# EAGLE design differential_led_board (EAGLE 9.2.1)

## Sheet 1 of 3: Differential RX; Input connectors; Power
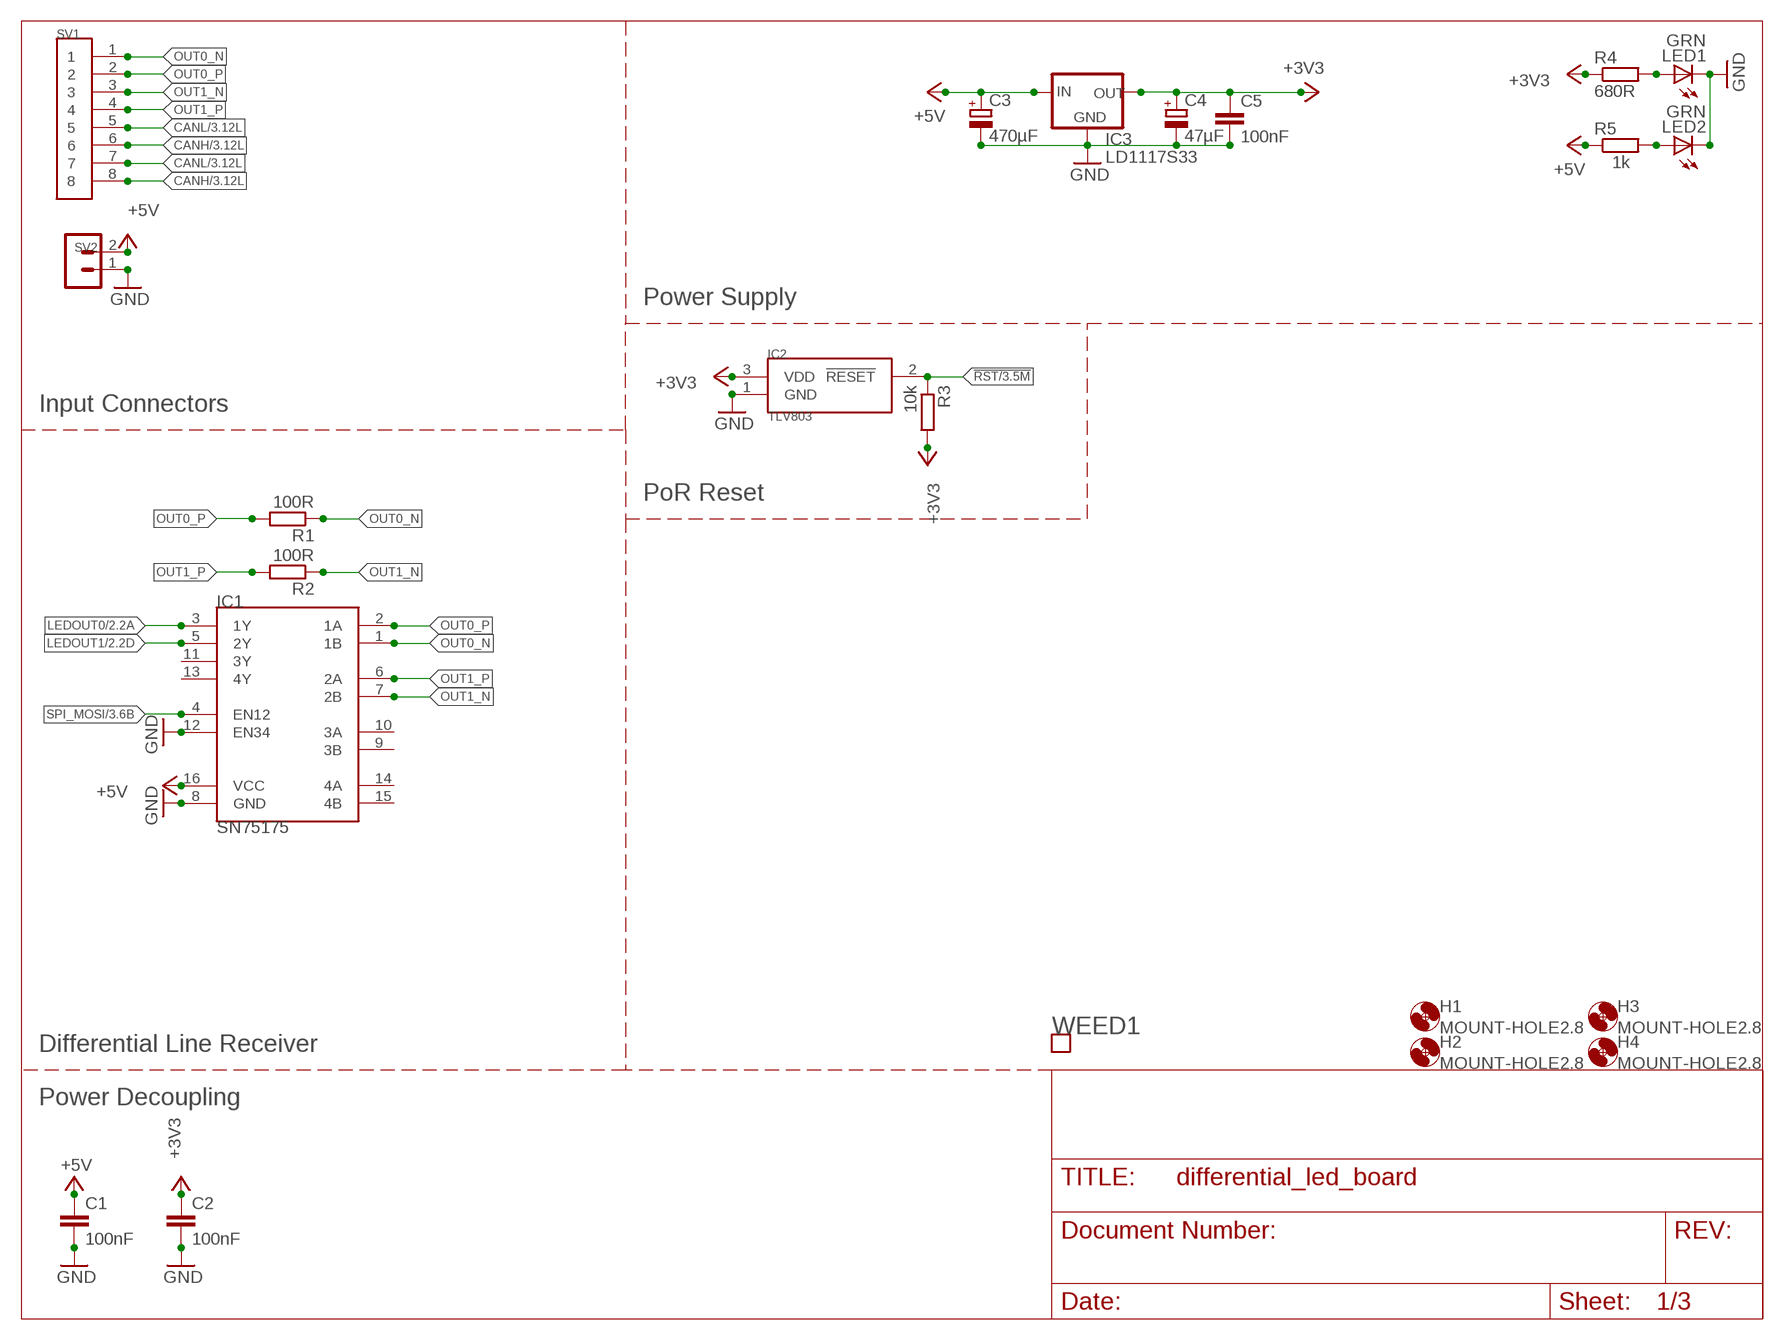
[diagram p0: schematic, sheet 1]

### Parts
C1  100nF  C-EUC0805  [C0805]
C2  100nF  C-EUC0805  [C0805]
C3  470µF  CPOL-EUUD-8X10  [UD-8X10_NICHICON]
C4  47µF  CPOL-EUCT6032  [CT6032]
C5  100nF  C-EUC0805  [C0805]
H1  MOUNT-HOLE2.8  [2,8]
H2  MOUNT-HOLE2.8  [2,8]
H3  MOUNT-HOLE2.8  [2,8]
H4  MOUNT-HOLE2.8  [2,8]
IC1  SN75175  SN75175SOP-16  [SOP-16]
IC2  TLV803  TLV803SOT-23  [SOT23]
IC3  LD1117S33  LM1117SOT223  [SOT223]
LED1  GRN  LEDCHIPLED_1206  [CHIPLED_1206]
LED2  GRN  LEDCHIPLED_1206  [CHIPLED_1206]
R1  100R  R-EU_M1206  [M1206]
R2  100R  R-EU_M1206  [M1206]
R3  10k  R-EU_M0805  [M0805]
R4  680R  R-EU_M0805  [M0805]
R5  1k  R-EU_M0805  [M0805]
SV1  SS-51000-003  [SS-51000-003]
SV2  1792863  [1792863]
WEED1  WEED  [DOINK]

### Nets
!RST: IC2.2(!RESET) R3.1 ; also sheet 3
+3V3: C2.1 C4.+ C5.1 IC2.3(VDD) IC3.2(OUT) IC3.4(OUT) R3.2 R4.1 ; also sheet 2,3
+5V: C1.1 C3.+ IC1.16(VCC) IC3.3(IN) R5.1 SV2.2 ; also sheet 2,3
CANH: SV1.6 SV1.8 ; also sheet 3
CANL: SV1.5 SV1.7 ; also sheet 3
GND: C1.2 C2.2 C3.- C4.- C5.2 IC1.8(GND) IC1.12(EN34) IC2.1(GND) IC3.1(GND) LED1.C LED2.C SV2.1 ; also sheet 2,3
LEDOUT0: IC1.3(1Y) ; also sheet 2
LEDOUT1: IC1.5(2Y) ; also sheet 2
N$1: LED1.A R4.2
N$2: LED2.A R5.2
OUT0_N: IC1.1(1B) R1.1 SV1.1
OUT0_P: IC1.2(1A) R1.2 SV1.2
OUT1_N: IC1.7(2B) R2.1 SV1.3
OUT1_P: IC1.6(2A) R2.2 SV1.4
SPI_MOSI: IC1.4(EN12) ; also sheet 3
Unconnected: IC1.9(3B) IC1.10(3A) IC1.11(3Y) IC1.13(4Y) IC1.14(4A) IC1.15(4B)

### Notes on the sheet
- Power Supply
- Input Connectors
- PoR Reset
- Differential Line Receiver
- Power Decoupling

## Sheet 2 of 3: Output MUX; LED connectors
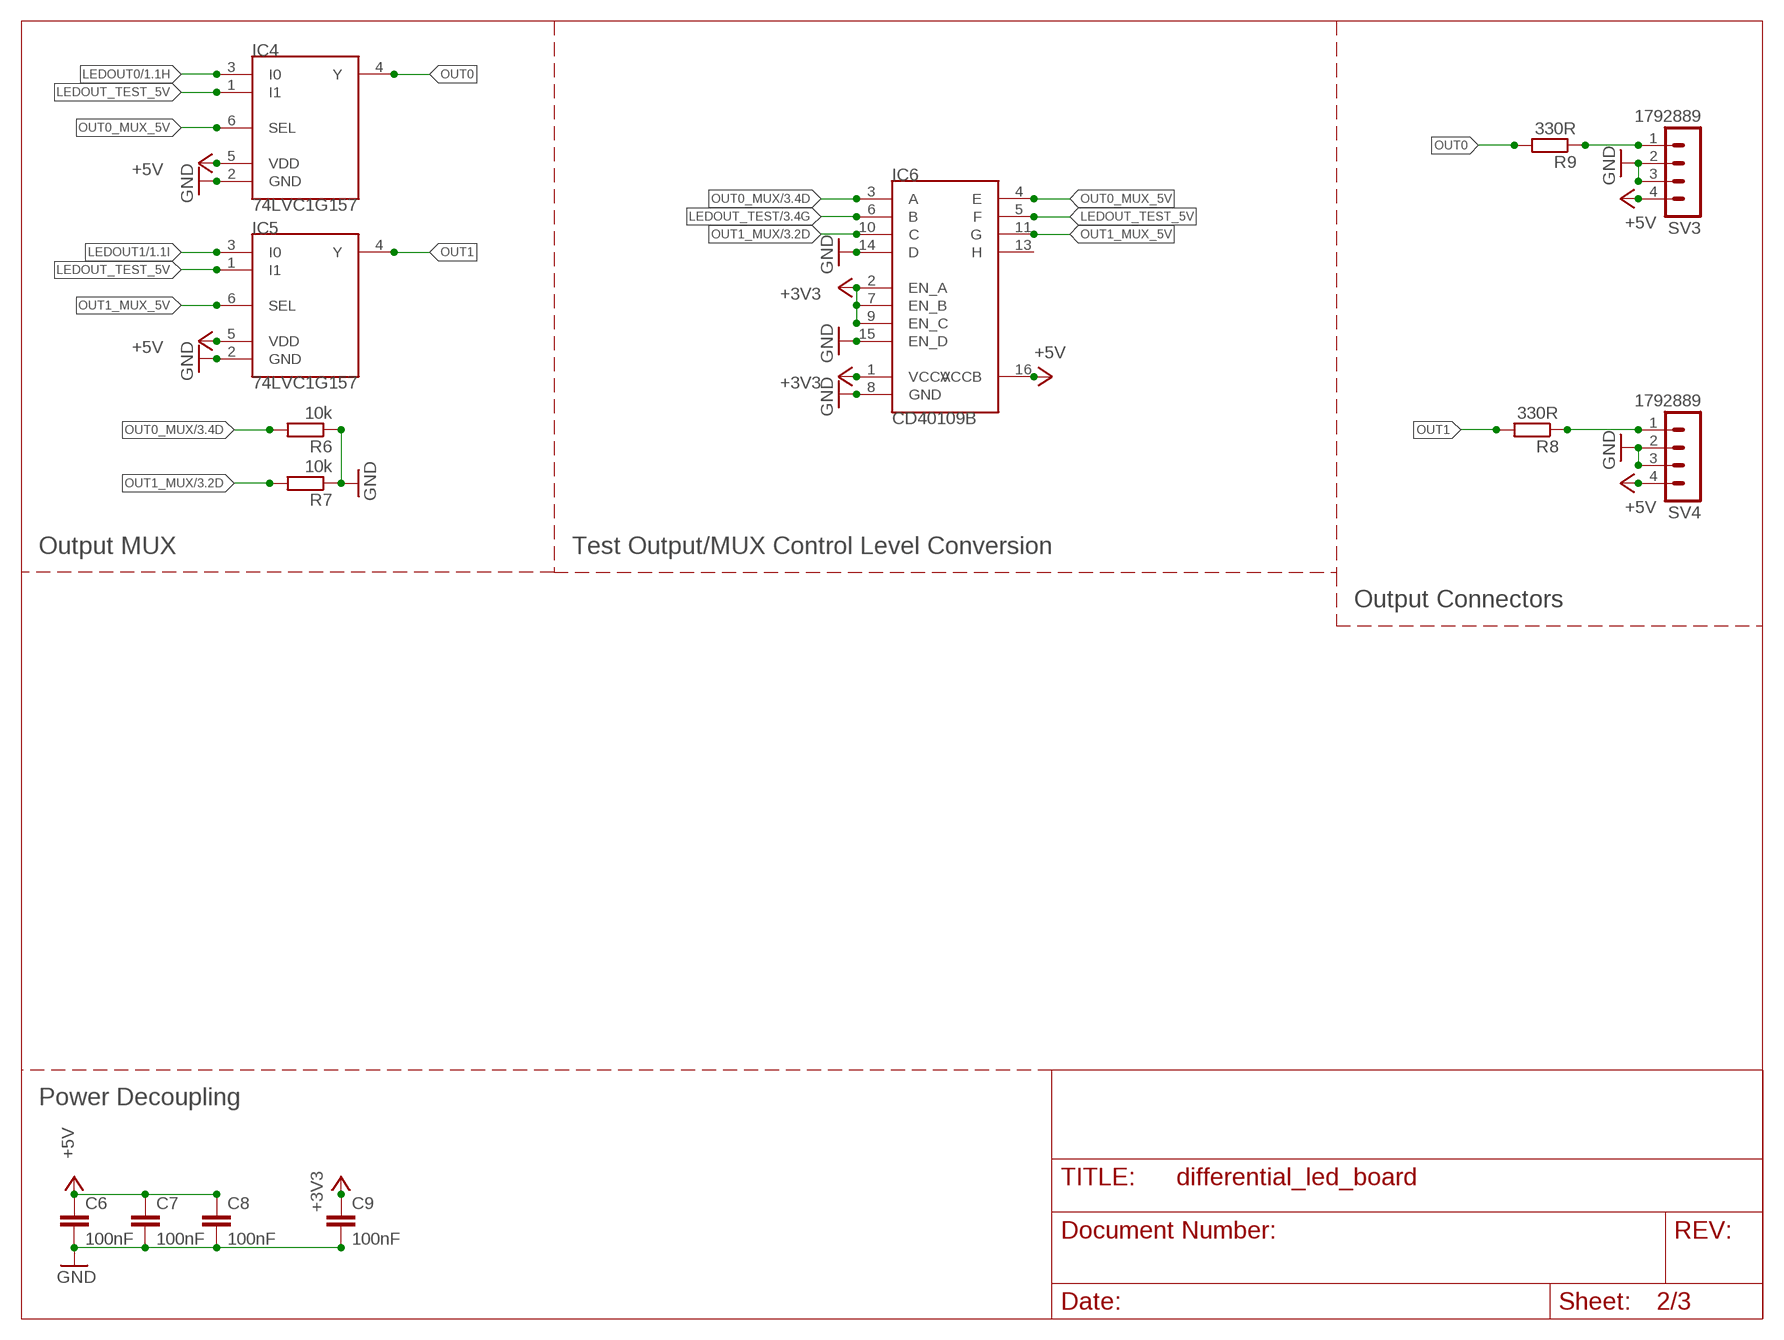
[diagram p1: schematic, sheet 2]

### Parts
C6  100nF  C-EUC0805  [C0805]
C7  100nF  C-EUC0805  [C0805]
C8  100nF  C-EUC0805  [C0805]
C9  100nF  C-EUC0805  [C0805]
IC4  74LVC1G157  74LVC1G157SOT457  [SOT457R_PHILIPS]
IC5  74LVC1G157  74LVC1G157SOT457  [SOT457R_PHILIPS]
IC6  CD40109B  CD40109BSO-16  [SO16]
R6  10k  R-EU_M0805  [M0805]
R7  10k  R-EU_M0805  [M0805]
R8  330R  R-EU_M0805  [M0805]
R9  330R  R-EU_M0805  [M0805]
SV3  1792889  [1792889]
SV4  1792889  [1792889]

### Nets
+3V3: C9.1 IC6.1(VCCA) IC6.2(EN_A) IC6.7(EN_B) IC6.9(EN_C) ; also sheet 1,3
+5V: C6.1 C7.1 C8.1 IC4.5(VDD) IC5.5(VDD) IC6.16(VCCB) SV3.4 SV4.4 ; also sheet 1,3
GND: C6.2 C7.2 C8.2 C9.2 IC4.2(GND) IC5.2(GND) IC6.8(GND) IC6.14(D) IC6.15(EN_D) R6.1 R7.1 SV3.2 SV3.3 SV4.2 SV4.3 ; also sheet 1,3
LEDOUT0: IC4.3(I0) ; also sheet 1
LEDOUT1: IC5.3(I0) ; also sheet 1
LEDOUT_TEST: IC6.6(B) ; also sheet 3
LEDOUT_TEST_5V: IC4.1(I1) IC5.1(I1) IC6.5(F)
N$3: R8.1 SV4.1
N$6: R9.1 SV3.1
OUT0: IC4.4(Y) R9.2
OUT0_MUX: IC6.3(A) R6.2 ; also sheet 3
OUT0_MUX_5V: IC4.6(SEL) IC6.4(E)
OUT1: IC5.4(Y) R8.2
OUT1_MUX: IC6.10(C) R7.2 ; also sheet 3
OUT1_MUX_5V: IC5.6(SEL) IC6.11(G)
Unconnected: IC6.13(H)

### Notes on the sheet
- Output MUX | Test Output/MUX Control Level Conversion
- Output Connectors
- Power Decoupling

## Sheet 3 of 3: CANnabus Controller
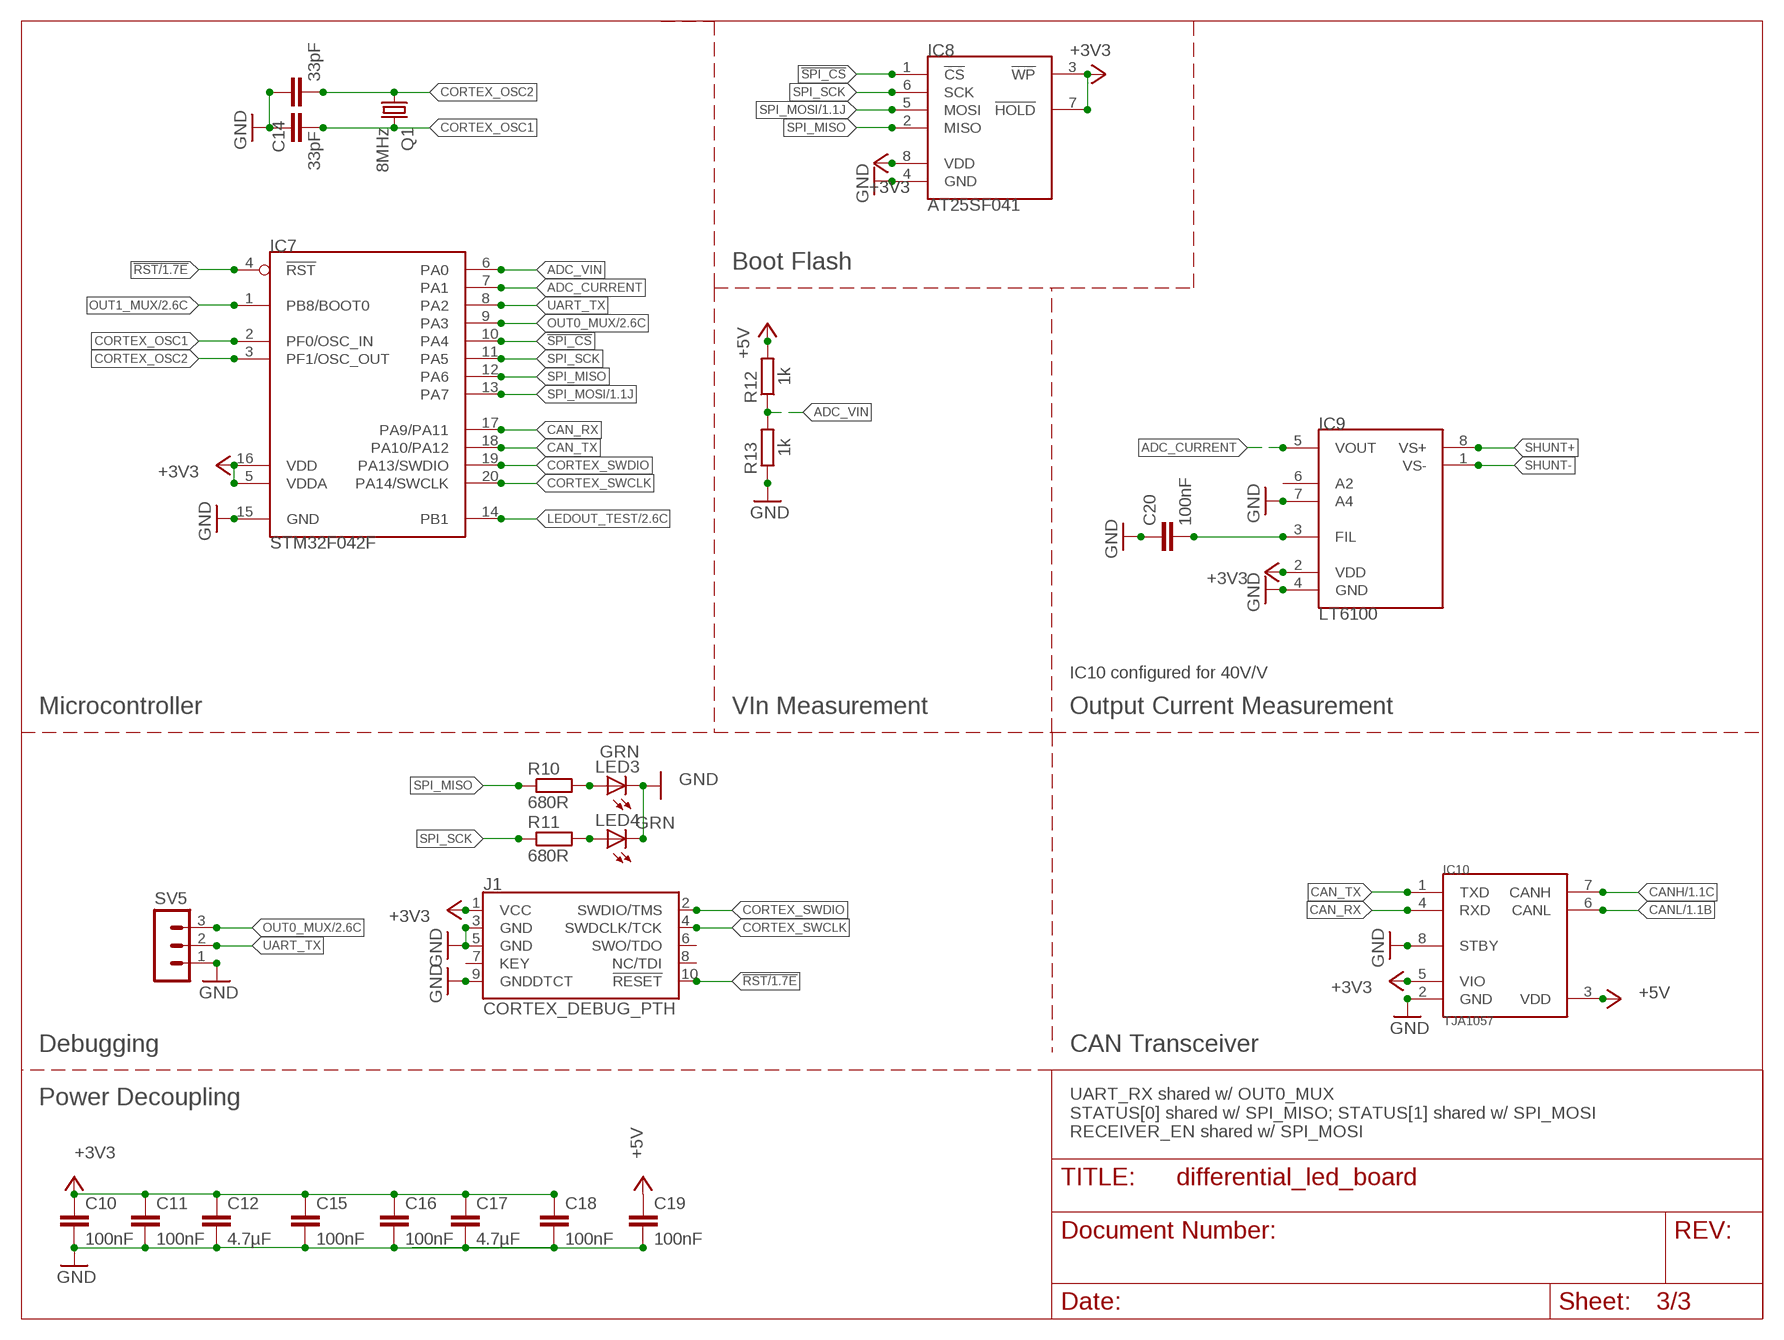
[diagram p2: schematic, sheet 3]

### Parts
C10  100nF  C-EUC0805  [C0805]
C11  100nF  C-EUC0805  [C0805]
C12  4.7µF  C-EUC0805  [C0805]
C13  33pF  C-EUC0805  [C0805]
C14  33pF  C-EUC0805  [C0805]
C15  100nF  C-EUC0805  [C0805]
C16  100nF  C-EUC0805  [C0805]
C17  4.7µF  C-EUC0805  [C0805]
C18  100nF  C-EUC0805  [C0805]
C19  100nF  C-EUC0805  [C0805]
C20  100nF  C-EUC0805  [C0805]
IC7  STM32F042F  [TSSOP20]
IC8  AT25SF041  [SOIC8]
IC9  LT6100  LT6100MSOP-8  [MSOP8]
IC10  TJA1057  [SOIC8]
J1  CORTEX_DEBUG_PTH  [2X5-PTH-1.27MM]
LED3  GRN  LEDCHIPLED_1206  [CHIPLED_1206]
LED4  GRN  LEDCHIPLED_1206  [CHIPLED_1206]
Q1  8MHz  CRYSTALHC49UP  [HC49UP]
R10  680R  R-EU_M0805  [M0805]
R11  680R  R-EU_M0805  [M0805]
R12  1k  R-EU_M0805  [M0805]
R13  1k  R-EU_M0805  [M0805]
SV5  MA03-1  [MA03-1]

### Nets
!RST: IC7.4(!RST) J1.10(!RESET) ; also sheet 1
!SPI_CS: IC7.10(PA4) IC8.1(!CS)
+3V3: C10.1 C11.1 C12.1 C15.1 C16.1 C17.1 C18.1 IC7.5(VDDA) IC7.16(VDD) IC8.3(!WP) IC8.7(!HOLD) IC8.8(VDD) IC9.2(VDD) IC10.5(VIO) J1.1(VCC) ; also sheet 1,2
+5V: C19.1 IC10.3(VDD) R12.2 ; also sheet 1,2
ADC_CURRENT: IC7.7(PA1) IC9.5(VOUT)
ADC_VIN: IC7.6(PA0) R12.1 R13.2
CAN_RX: IC7.17(PA9/PA11) IC10.4(RXD)
CAN_TX: IC7.18(PA10/PA12) IC10.1(TXD)
CANH: IC10.7(CANH) ; also sheet 1
CANL: IC10.6(CANL) ; also sheet 1
CORTEX_OSC1: C14.2 IC7.2(PF0/OSC_IN) Q1.2
CORTEX_OSC2: C13.2 IC7.3(PF1/OSC_OUT) Q1.1
CORTEX_SWCLK: IC7.20(PA14/SWCLK) J1.4(SWDCLK/TCK)
CORTEX_SWDIO: IC7.19(PA13/SWDIO) J1.2(SWDIO/TMS)
GND: C10.2 C11.2 C12.2 C13.1 C14.1 C15.2 C16.2 C17.2 C18.2 C19.2 C20.1 IC7.15(GND) IC8.4(GND) IC9.4(GND) IC9.7(A4) IC10.2(GND) IC10.8(STBY) J1.3(GND) J1.5(GND) J1.9(GNDDTCT) LED3.C LED4.C R13.1 SV5.1 ; also sheet 1,2
LEDOUT_TEST: IC7.14(PB1) ; also sheet 2
N$4: LED3.A R10.2
N$5: LED4.A R11.2
N$7: C20.2 IC9.3(FIL)
OUT0_MUX: IC7.9(PA3) SV5.3 ; also sheet 2
OUT1_MUX: IC7.1(PB8/BOOT0) ; also sheet 2
SHUNT+: IC9.8(VS+)
SHUNT-: IC9.1(VS-)
SPI_MISO: IC7.12(PA6) IC8.2(MISO) R10.1
SPI_MOSI: IC7.13(PA7) IC8.5(MOSI) ; also sheet 1
SPI_SCK: IC7.11(PA5) IC8.6(SCK) R11.1
UART_TX: IC7.8(PA2) SV5.2
Unconnected: IC9.6(A2) J1.6(SWO/TDO) J1.7(KEY) J1.8(NC/TDI)

### Notes on the sheet
- Boot Flash
- IC10 configured for 40V/V
- Microcontroller | VIn Measurement | Output Current Measurement
- Debugging | CAN Transceiver
- UART_RX shared w/ OUT0_MUX
  STATUS[0] shared w/ SPI_MISO; STATUS[1] shared w/ SPI_MOSI
  RECEIVER_EN shared w/ SPI_MOSI
- Power Decoupling

## Library data of the parts
C1 C2 C5-C11 C15 C16 C18 C19 = rcl:C-EU: CAPACITOR, European symbol; MOUSER: 710-885012207072; SPICEPREFIX: C
C3 = rcl:CPOL-EU: POLARIZED CAPACITOR, European symbol; MOUSER: 647-UWT1C471MNL1S; SPICEPREFIX: C
C4 = rcl:CPOL-EU: POLARIZED CAPACITOR, European symbol; MOUSER: 581-TAJD476M016RNJV; SPICEPREFIX: C
C12 C17 = rcl:C-EU: CAPACITOR, European symbol; MOUSER: 81-GRM21BR71A475ME1L; SPICEPREFIX: C
C13 C14 = rcl:C-EU: CAPACITOR, European symbol; MOUSER: 710-885012007013; SPICEPREFIX: C
C20 = rcl:C-EU: CAPACITOR, European symbol; MOUSER: 710-885012007059; SPICEPREFIX: C
H1-H4 = holes:MOUNT-HOLE: MOUNTING HOLE with drill center marker
IC1 = lichtenstein_onion:SN75175: QUADRUPLE DIFFERENTIAL LINE RECEIVERS Datasheet <http://www.ti.com/lit/ds/symlink/sn75175.pdf>; MOUSER: 595-SN75175DR
IC2 = lichtenstein_onion:TLV803: 3-Pin Voltage Supervisors with Active-Low, Open-Drain Reset Datasheet <http://www.ti.com/general/docs/lit/getliterature.tsp?genericPartNumber=tlv803&fileType=pdf> Note: Mouser part number for TLV803S; 2.93V threshold voltage; MOUSER: 595-TLV803SDBZR
IC3 = lichtenstein_onion:LM1117: Voltage Regulator LM1117 Information <http://www.st.com/en/power-management/ld1117.html>; MOUSER: 926-LM1117MPX3.3NOPB
IC4 IC5 = lichtenstein_onion:74LVC1G157: Single 2-input multiplexer Datasheet <https://www.mouser.com/datasheet/2/916/74LVC1G157-1319565.pdf>; MOUSER: 771-74LVC1G157GV-G
IC6 = lichtenstein_onion:CD40109B: Automotive catalog CMOS Quad Low-to-High Voltage Level Shifter (20V Rating) Datasheet <http://www.ti.com/lit/ds/symlink/cd40109b-q1.pdf>; MOUSER: 595-CD40109BNSR
IC7 = lichtenstein_onion:STM32F042F: STM32F042Fx – Mainstream ARM Cortex-M0 USB line MCU with 32 Kbytes Flash, 48 MHz CPU, USB, CAN and CEC functions Datasheet <https://www.st.com/resource/en/datasheet/stm32f042f6.pdf> STM32F042x6 <https://www.st.com/content/st_com/en/products/microcontrollers/stm32-32-bit-arm-cortex-mcus/stm32-mainstream-mcus/stm32f0-series/stm32f0x2/stm32f042f6.html>: 32K flash, 6K SRAM STM32F042x4 <https://www.st.com/content/st_com/en/products/microcontrollers/stm32-32-bit-arm-cortex-mcus/stm32-mainstream-mcus/stm32f0-series/stm32f0x2/stm32f042f4.html>: 16K flash, 6K SRAM; MOUSER: 511-STM32F042F6P6
IC8 = lichtenstein_onion:AT25SF041: AT25SF041 – 4-Mbit, 2.5V Minimum SPI Serial Flash Memory with Dual-I/O and Quad-I/O Support Datasheet <https://www.mouser.com/datasheet/2/590/DS-AT25SF041_044-1385758.pdf>; MOUSER: 988-AT25SF041-SSHD-T
IC9 = lichtenstein_onion:LT6100: Precision, Gain Selectable High Side Current Sense Amplifier Datasheet <https://www.analog.com/media/en/technical-documentation/data-sheets/6100fd.pdf>; MOUSER: 584-LT6100CMS8#PBF
IC10 = lichtenstein_onion:TJA1057: TJA1057 – High-speed CAN transceiver Information <https://www.nxp.com/products/analog/interfaces/in-vehicle-network/can-transceiver-and-controllers/high-speed-can-transceiver-mantis-family:TJA1057> Datasheet <https://www.nxp.com/docs/en/data-sheet/TJA1057.pdf>; MOUSER: 771-TJA1057GT/3J
J1 = lichtenstein_onion:CORTEX_DEBUG: Cortex Debug Connector - 10 pin; MOUSER: 649-221111-00010T4LF
LED1-LED4 = led:LED: LED OSRAM: - CHIPLED LG R971, LG N971, LY N971, LG Q971, LY Q971, LO R971, LY R971 LH N974, LH R974 LS Q976, LO Q976, LY Q976 LO Q996 - Hyper CHIPLED LW Q18S LB Q993, LB Q99A, LB R99A - SideLED LS A670, LO A670, LY A670, LG A670, LP A670 LB A673, LV A673, LT A673, LW A673 LH A674 LY A675 LS A676, LA A676, LO A676, LY A676, LW A676 LS A679, LY A679, LG A679 - Hyper Micro SIDELED® LS Y876, LA Y876, LO Y876, LY Y876 LT Y87S - SmartLED LW L88C, LW L88S LB L89C, LB L89S, LG L890 LS L89K, LO L89K, LY L89K LS L896, LA L896, LO L896, LY L896 - TOPLED LS T670, LO T670, LY T670, LG T670, LP T670 LSG T670, LSP T670, LSY T670, LOP T670, LYG T670 LG T671, LOG T671, LSG T671 LB T673, LV T673, LT T673, LW T673 LH T674 LS T676, LA T676, LO T676, LY T676, LB T676, LH T676, LSB T676, LW T676 LB T67C, LV T67C, LT T67C, LS T67K, LO T67K, LY T67K, LW E67C LS E67B, LA E67B, LO E67B, LY E67B, LB E67C, LV E67C, LT E67C LW T67C LS T679, LY T679, LG T679 LS T770, LO T770, LY T770, LG T770, LP T770 LB T773, LV T773, LT T773, LW T773 LH T774 LS E675, LA E675, LY E675, LS T675 LS T776, LA T776, LO T776, LY T776, LB T776 LHGB T686 LT T68C, LB T68C - Hyper Mini TOPLED® LB M676 - Mini TOPLED Santana® LG M470 LS M47K, LO M47K, LY M47K Source: http://www.osram.convergy.de LUXEON: - LUMILED® LXK2-PW12-R00, LXK2-PW12-S00, LXK2-PW14-U00, LXK2-PW14-V00 LXK2-PM12-R00, LXK2-PM12-S00, LXK2-PM14-U00 LXK2-PE12-Q00, LXK2-PE12-R00, LXK2-PE12-S00, LXK2-PE14-T00, LXK2-PE14-U00 LXK2-PB12-K00, LXK2-PB12-L00, LXK2-PB12-M00, LXK2-PB14-N00, LXK2-PB14-P00, LXK2-PB14-Q00 LXK2-PR12-L00, LXK2-PR12-M00, LXK2-PR14-Q00, LXK2-PR14-R00 LXK2-PD12-Q00, LXK2-PD12-R00, LXK2-PD12-S00 LXK2-PH12-R00, LXK2-PH12-S00 LXK2-PL12-P00, LXK2-PL12-Q00, LXK2-PL12-R00 Source: www.luxeon.com KINGBRIGHT: KA-3528ASYC Source: www.kingbright.com; MOUSER: 604-APTR3216SGC
Q1 = crystal:CRYSTAL: CRYSTAL; MOUSER: 449-LFXTAL030234REEL; OC_FARNELL: unknown; OC_NEWARK: unknown
R1 R2 = rcl:R-EU_: RESISTOR, European symbol; MOUSER: 652-CR1206FX-1000ELF; SPICEPREFIX: R
R3 R6 R7 = rcl:R-EU_: RESISTOR, European symbol; MOUSER: 755-ESR10EZPJ103; SPICEPREFIX: R
R4 R10 R11 = rcl:R-EU_: RESISTOR, European symbol; MOUSER: 652-CR0805-FX6800GLF; SPICEPREFIX: R
R5 R12 R13 = rcl:R-EU_: RESISTOR, European symbol; MOUSER: 755-ESR10EZPJ102; SPICEPREFIX: R
R8 R9 = rcl:R-EU_: RESISTOR, European symbol; MOUSER: 71-CRCW0805330RFKEAC; SPICEPREFIX: R
SV1 = lichtenstein_onion:SS-51000-003: SS-51000-003 – Unshielded, CAT6a, Punch Down Block, 8P 8C Information <https://belfuse.com/product/part-details?partn=SS-51000-003> Mechanical Drawing <https://belfuse.com/resources/drawings/stewartconnector/dr-stw-ss-51000-003.pdf> Compatible with SS-51000-004 (same connector but with color coded terminals for CAT6 cable); MOUSER: 530-SS-51000-003
SV2 = lichtenstein_onion:1792863: PCB terminal block - PTS 1,5/ 2-5,0-H - 1792863 Footprint Proven Information <https://www.phoenixcontact.com/online/portal/us?uri=pxc-oc-itemdetail:pid=1792863&library=usen&tab=1>; MOUSER: 651-1792863
SV3 SV4 = lichtenstein_onion:1792889; MOUSER: 651-1792889
SV5 = con-lstb:MA03-1: PIN HEADER; OC_FARNELL: unknown; OC_NEWARK: unknown
WEED1 = lichtenstein_onion:WEED

## Net classes
0 default: width 0.254 mm
1 hi_power: width 2.54 mm

## Board
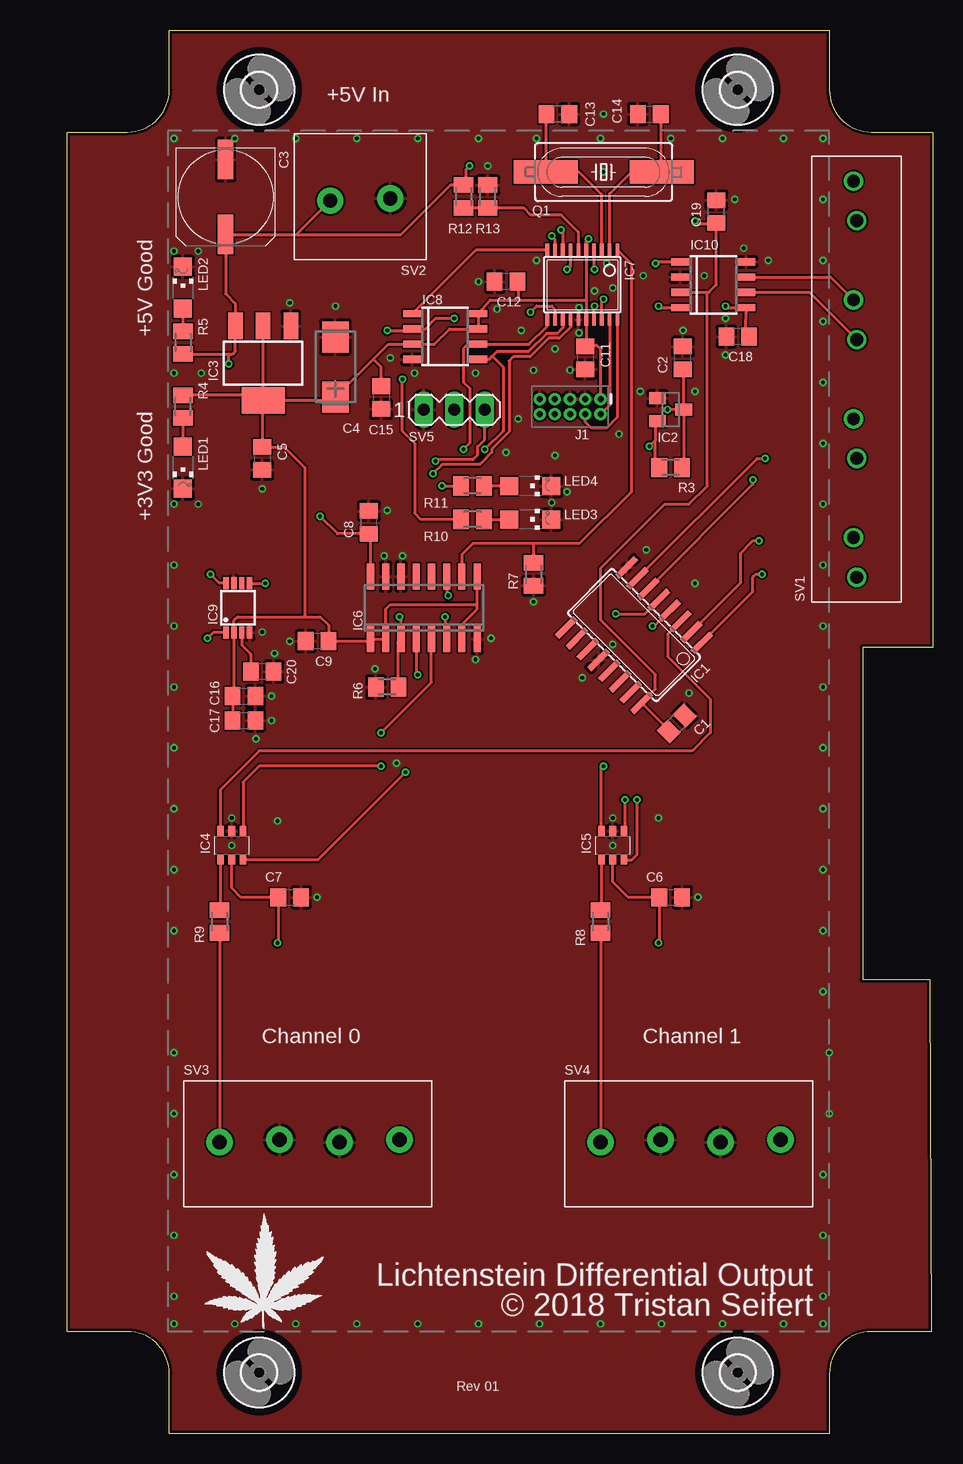
[diagram p3: board, top side]
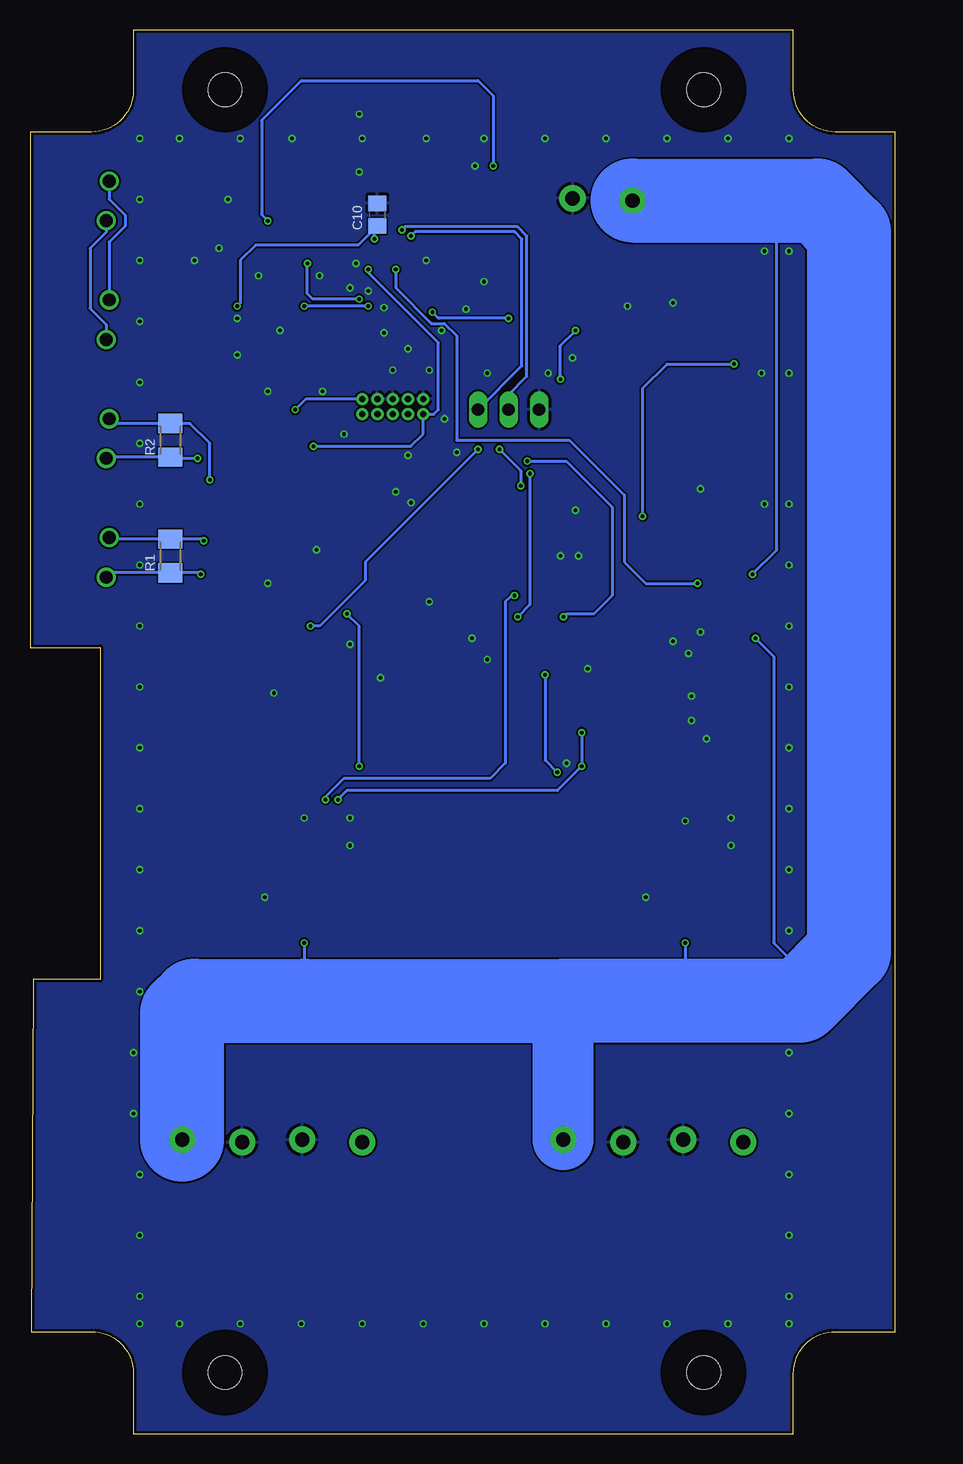
[diagram p4: board, bottom side, seen from below]

Size 72.12 x 117 mm. Coordinates in mm from the lower left corner, seen from the top.
Outline: 0,8.5 0,108.5 5,108.5 arc90 8.5,112 8.5,117 63.5,117 63.5,112 arc90 67,108.5 72.12,108.5 72.12,65.54 66.28,65.54 66.28,37.85 71.87,37.85 71.87,37.34 72,8.5 67,8.5 arc90 63.5,5 63.5,0 8.5,0 8.5,5 arc90 5,8.5 0,8.5
Copper layers (1*16): Top 0.035mm / dielectric 1.5mm / Bottom 0.035mm
Design rules "dirt_cheap_dirty_boards.v1.1": minimum track width 6mil, minimum drill 12mil, track to track 6mil, track to pad 6mil, pad to pad 6mil, via to via 6mil, smd to smd 0mil, copper to edge 10mil, drill to drill 10mil, minimum pad ring 10mil, minimum via ring 6mil, stop-mask expansion 2mil, vias tented up to drill 25mil, thermal gap 10mil

### Footprints (pad centres in the part's own frame; a part is rotated, then mirrored left to right if it is on the bottom)
C0805 = smd 1.3 x 1.5: 1 -0.95,0; 2 0.95,0
UD-8X10_NICHICON = smd 3.3 x 1.3: + 3.125,0; - -3.125,0
CT6032 = smd 2.6 x 2.2: + -2.5,0; - 2.5,0
2,8 = hole 2.8: 0,0
SOP-16 = smd 0.5 x 2.2: 1 -4.445,-3.55; 2 -3.185,-3.55; 3 -1.915,-3.55; 4 -0.645,-3.55; 5 0.635,-3.55; 6 1.895,-3.55; 7 3.165,-3.55; 8 4.435,-3.55; 9 4.445,3.55; 10 3.175,3.55; 11 1.905,3.55; 12 0.635,3.55; 13 -0.635,3.55; 14 -1.905,3.55; 15 -3.175,3.55; 16 -4.445,3.55
SOT23 = smd 1 x 1.4: 1 -0.95,-1.1; 2 0.95,-1.1; 3 0,1.1
SOT223 = smd 1.219 x 2.235: 1 -2.311,-3.099; 2 0,-3.099; 3 2.311,-3.099 | smd 3.6 x 2.2: 4 0,3.099
SOT457R_PHILIPS = smd 0.55 x 0.8: 1 -0.95,-1.2; 2 0,-1.2; 3 0.95,-1.2; 4 0.95,1.2; 5 0,1.2; 6 -0.95,1.2
SO16 = smd 0.6 x 2.2: 1 -4.445,-2.6; 2 -3.175,-2.6; 3 -1.905,-2.6; 4 -0.635,-2.6; 5 0.635,-2.6; 6 1.905,-2.6; 7 3.175,-2.6; 8 4.445,-2.6; 9 4.445,2.6; 10 3.175,2.6; 11 1.905,2.6; 12 0.635,2.6; 13 -0.635,2.6; 14 -1.905,2.6; 15 -3.175,2.6; 16 -4.445,2.6
TSSOP20 = smd 0.305 x 0.991: 1 -2.925,-2.918; 2 -2.275,-2.918; 3 -1.625,-2.918; 4 -0.975,-2.918; 5 -0.325,-2.918; 6 0.325,-2.918; 7 0.975,-2.918; 8 1.625,-2.918; 9 2.275,-2.918; 10 2.925,-2.918; 11 2.925,2.918; 12 2.275,2.918; 13 1.625,2.918; 14 0.975,2.918; 15 0.325,2.918; 16 -0.325,2.918; 17 -0.975,2.918; 18 -1.625,2.918; 19 -2.275,2.918; 20 -2.925,2.918
SOIC8 = smd 0.6 x 1.5: 1 -1.905,-2.75; 2 -0.635,-2.75; 3 0.635,-2.75; 4 1.905,-2.75; 5 1.905,2.75; 6 0.635,2.75; 7 -0.635,2.75; 8 -1.905,2.75
MSOP8 = smd 0.45 x 1: 1 -0.975,-2.05; 2 -0.325,-2.05; 3 0.325,-2.05; 4 0.975,-2.05; 5 0.975,2.05; 6 0.325,2.05; 7 -0.325,2.05; 8 -0.975,2.05
2X5-PTH-1.27MM = drill 0.508 pad 1: 1 -2.54,-0.635; 2 -2.54,0.635; 3 -1.27,-0.635; 4 -1.27,0.635; 5 0,-0.635; 6 0,0.635; 7 1.27,-0.635; 8 1.27,0.635; 9 2.54,-0.635; 10 2.54,0.635
CHIPLED_1206 = smd 1.5 x 1.5: A 0,-1.75; C 0,1.75
HC49UP = smd 5.334 x 1.93: 1 -4.826,0; 2 4.826,0
M1206 = smd 1.6 x 2: 1 -1.4,0; 2 1.4,0
M0805 = smd 1.3 x 1.6: 1 -0.95,0; 2 0.95,0
SS-51000-003 = drill 1.067: 1 0,0; 2 3.302,0.254; 3 9.906,0; 4 13.208,0.254; 5 19.812,0; 6 23.114,0.254; 7 29.718,0; 8 33.02,0.254
1792863 = drill 1.2 pad 2.2: 1 0,-0.1; 2 5,0.1
1792889 = drill 1.2 pad 2.2: 1 -7.62,-0.1; 2 -2.62,0.1; 3 2.38,-0.1; 4 7.38,0.1
MA03-1 = drill 1.016 long: 1 -2.54,0; 2 0,0; 3 2.54,0

### Placement (x,y rotation side)
C1  50.79,59.19 45 top
C2  51.29,89.67 90 top
C3  13.19,103.08 270 top
C4  22.34,88.9 90 top
C5  16.24,81.28 270 top
C6  50.28,44.71 0 top
C7  18.53,44.71 0 top
C8  25.13,75.95 90 top
C9  20.81,66.04 180 top
C10  43.17,101.6 90 bottom
C11  43.17,89.67 270 top
C12  36.56,96.02 180 top
C13  40.88,109.99 180 top
C14  48.5,109.99 0 top
C15  26.15,86.36 270 top
C16  14.72,61.47 0 top
C17  14.72,59.44 0 top
C18  55.87,91.44 180 top
C19  54.09,101.86 90 top
C20  16.24,63.5 180 top
H1  15.99,112.02 0 top
H2  15.99,5.08 0 top
H3  55.87,5.08 0 top
H4  55.87,112.02 0 top
IC1  47.23,66.55 135 top
IC2  50.28,85.35 270 top
IC3  16.32,89.23 180 top
IC4  13.7,49.03 180 top
IC5  45.45,49.03 180 top
IC6  29.7,68.84 0 top
IC7  42.91,95.76 180 top
IC8  31.48,91.44 270 top
IC9  14.21,68.84 0 top
IC10  53.83,95.76 270 top
J1  41.9,85.6 180 top
LED1  9.64,80.52 180 top
LED2  9.64,95.51 0 top
LED3  38.59,76.2 270 top
LED4  38.59,79 270 top
Q1  44.69,105.16 0 top
R1  60.44,73.16 90 bottom
R2  60.44,82.81 90 bottom
R3  50.28,80.52 0 top
R4  9.64,85.6 270 top
R5  9.64,90.94 90 top
R6  26.66,62.23 0 top
R7  38.85,71.63 90 top
R8  44.44,42.68 90 top
R9  12.69,42.68 90 top
R10  33.77,76.2 0 top
R11  33.77,79 0 top
R12  33.01,103.13 90 top
R13  35.04,103.13 270 top
SV1  65.77,71.38 90 top
SV2  26.91,102.87 180 top
SV3  20.31,24.39 0 top
SV4  52.06,24.39 0 top
SV5  32.24,85.35 0 top
WEED1  11.42,8.64 0 top

### Tracks (layer width: path | path; a pad name or v marks a point on that pad's centre or on a via)
!RST  (via drill 0.3)
  Top 0.254: IC7.4 43.89,97.07 v43.93,97.03 | IC2.2 49.01,84.23 49.01,83.06 49.01,82.81 | 49.01,82.81 v48.5,82.3 | R3.1 49.01,80.84 49.01,82.81
  Bottom 0.254: v43.93,97.03 43.93,96.78 38.09,90.94 38.09,85.35 38.47,84.97 J1.10 39.36,83.32 40.37,82.3 v48.5,82.3
!SPI_CS
  Top 0.254: IC8.1 34.06,98.68 IC7.10
+3V3  (via drill 0.3)
  Top 0.254: R4.1 15.9,86.55 IC3.4 | IC3.4 22.07,86.14 C4.+ 25.49,89.56 | IC3.4 16.24,86.06 C5.1 18.09,82.23 19.8,80.52 19.8,68.08 | 25.49,89.56 26.74,90.81 IC8.3 30.59,90.81 31.86,92.08 IC8.7 IC8.8 35.23,94.49 37.58,94.49 | 43.24,94.49 IC7.16 43.24,90.69 | 37.58,94.49 43.24,94.49 | 43.24,94.49 IC7.5 43.24,99.39 v43.42,99.57 | C15.1 26.15,88.9 25.49,89.56 | C12.1 37.58,95.95 37.58,94.49 | 43.24,90.69 C11.1 | J1.1 44.44,90.43 44.18,90.69 43.24,90.69 | C18.1 56.43,91.83 IC10.5 54.98,93.86 v54.85,93.98 | IC3.4 IC3.2 | C17.1 C16.1 13.89,61.59 IC9.2 13.89,67.75 14.21,68.08 19.8,68.08 | IC6.7 32.88,67.44 34.15,68.71 34.15,69.09 | 34.15,69.09 IC6.9 | 19.8,68.08 21.07,68.08 21.76,67.38 C9.1 25.07,66.04 IC6.1 IC6.2 26.53,68.71 26.91,69.09 34.15,69.09 | IC2.3 v50.02,85.35 | IC2.3 51.38,88.63 C2.1 | IC2.3 51.38,80.67 R3.2
  Bottom 0.254: v43.42,99.57 43.42,100.4 C10.1 44.76,99.06 53.33,99.06 54.6,97.79 54.6,94.24 v54.85,93.98 | J1.1 49.14,86.24 v50.02,85.35
+5V  (via drill 0.3)
  Top 0.254: R5.1 13.45,89.99 | 13.45,89.99 13.77,89.99 14.01,90.23 IC3.3 14.01,94.19 13.19,95 C3.+ 19.09,99.95 | 19.09,99.95 SV2.2 | 19.09,99.95 27.8,99.95 31.92,104.08 R12.2 33.26,104.33 33.26,105.41 v33.51,105.67 | IC10.3 53.33,95.13 | 53.33,95.13 53.45,95.13 54.09,95.76 C19.1 54.02,100.84 52.56,100.84 v52.31,101.1 | C1.1 50.11,58.65 IC1.16 49.01,62.04 49.01,63.25 44.44,67.82 44.44,72.14 49.77,77.47 51.8,77.47 53.33,79 53.33,95.13 | IC4.5 13.7,45.47 14.46,44.71 C7.1 17.58,40.96 v17.51,40.9 | IC5.5 45.45,45.98 46.72,44.71 C6.1 49.33,40.96 v49.26,40.9 | IC6.16 25.26,74.87 C8.1 22.53,75 v21.07,76.46 | v13.45,89.16 13.45,89.99
  Bottom 0.254: v52.31,101.1 52.82,101.6 52.82,109.48 49.52,112.78 34.78,112.78 33.51,111.51 v33.51,105.67 | v49.26,40.9 49.26,36.07 | v17.51,40.9 17.51,36.07 | v21.07,76.46 21.07,87.13 19.04,89.16 v13.45,89.16
  Bottom 5.08: SV3.4 27.69,36.06
  Bottom 6.985: SV2.2 6.49,102.77 3.87,100.16 3.87,40.14 7.94,36.07 17.51,36.07 27.67,36.07 | 27.67,36.07 49.26,36.07 58.41,36.07 59.44,35.04 SV4.4 | 27.69,36.06 27.67,36.07
ADC_CURRENT  (via drill 0.3)
  Top 0.254: IC7.7 41.9,98.64 41.9,97.29 v41.64,97.03 | v16.5,70.87 15.2,70.87 IC9.5
  Bottom 0.254: v41.64,97.03 41.64,95.51 38.67,92.54 37.59,92.54 36.56,91.51 36.56,82.81 27.16,82.81 22.59,78.24 22.59,72.65 20.81,70.87 v16.5,70.87
ADC_VIN
  Top 0.254: R12.1 R13.2 38.02,102.18 38.59,101.6 41.13,101.6 42.59,100.15 IC7.6
CAN_RX  (via drill 0.3)
  Top 0.254: IC7.17 43.89,93.94 v43.93,93.98 | v49.26,93.98 49.39,93.86 IC10.4
  Bottom 0.254: v43.93,93.98 v49.26,93.98
CAN_TX  (via drill 0.3)
  Top 0.254: IC7.18 44.54,94.42 v44.69,94.57 | v49.01,97.54 49.14,97.67 IC10.1
  Bottom 0.254: v44.69,94.57 48.58,94.57 49.01,95 v49.01,97.54
CANH
  Top 0.254: IC10.7 63.61,96.4 SV1.6
  Bottom 0.254: SV1.8 65.52,102.88 64.18,101.54 64.18,100.65 65.52,99.32 SV1.6
CANL
  Top 0.254: IC10.6 61.84,95.13 SV1.5
  Bottom 0.254: SV1.7 65.77,100.14 67.11,98.81 67.11,93.79 65.77,92.46 SV1.5
CORTEX_OSC1
  Top 0.254: IC7.2 45.19,103.37 46.98,105.16 Q1.2 49.45,105.23 C14.2
CORTEX_OSC2
  Top 0.254: IC7.3 44.54,103.28 42.66,105.16 Q1.1 39.87,109.92 C13.2
CORTEX_SWCLK
  Top 0.254: J1.4 43.17,84.33 43.67,83.82 44.94,83.82 45.84,84.72 IC7.20
CORTEX_SWDIO
  Top 0.254: IC7.19 45.19,86.6 45.22,86.56 45.22,85.75 J1.2
GND  (via drill 0.3)
  other vias: 39.1,97.79 37.83,91.95 22.34,93.98 18.53,94.24 28.94,88.4 16.24,78.74 8.88,107.95 13.96,107.95 19.04,107.95 24.12,107.95 29.2,107.95 39.1,107.95 44.44,107.95 54.6,107.95 50.28,107.95 34.28,107.95 59.68,107.95 62.98,107.95 62.98,102.87 62.98,97.79 62.98,92.71 62.98,87.63 62.98,82.55 62.98,77.47 62.98,72.39 62.98,67.31 62.98,62.23 62.98,57.15 62.98,52.07 62.98,46.99 62.98,41.91 62.98,36.83 63.49,31.75 63.49,26.67 62.98,21.59 62.98,16.51 62.98,11.43 62.98,9.15 59.68,9.15 54.6,9.15 49.52,9.15 44.44,9.15 39.36,9.15 34.28,9.15 29.2,9.15 24.12,9.15 19.04,9.15 13.96,9.15 8.88,9.15 8.88,11.43 8.88,16.51 8.88,21.59 8.88,26.67 8.88,31.75 8.88,41.91 8.88,46.99 8.88,52.07 8.88,57.15 8.88,62.23 8.88,67.31 8.88,72.39 8.88,77.47 8.88,88.4 8.88,98.56 53.07,96.52 58.41,97.79 42.63,93.86 40.63,90.43 38.85,88.65 41.9,88.65 37.58,84.59 42.63,91.75 41.64,78.49 40.37,77.6 51.8,61.73 48.25,73.66 52.31,70.87 45.45,65.79 52.56,44.71 49.26,51.31 20.81,44.71 17.51,51.06 45.45,51.31 54.85,92.97 54.85,89.92 55.61,102.87 56.37,98.81 35.8,93.73 34.02,88.4 36.56,81.79 45.45,95.51 44.94,97.54 43.93,95.25 45.96,83.32 13.7,51.31 13.7,49.03 45.45,49.03 16.24,66.81 17.26,65.03 15.73,57.92 17,59.44 17,61.47 26.4,73.16 34.02,64.52 35.29,66.3 38.85,69.35 18.53,66.04 27.42,55.88 10.91,77.47 11.16,88.4 10.91,98.56 35.04,105.67 34.28,96.02 26.91,89.67 26.66,76.97 25.64,63.76 42.91,63 40.63,81.54 47.74,86.87 51.29,91.95 52.31,86.87 47.99,96.52 44.69,109.99 44.69,105.16 27.93,73.16
  pour Top: -0.01,116.84 71.87,116.84 71.87,49.43 71.87,34.17 71.87,0 -0.01,0
  pour Bottom: -0.01,116.84 71.87,116.84 71.87,0 -0.01,0
LEDOUT0
  Top 0.254: IC1.3 50.02,66.64 50.02,64.77 53.58,61.22 53.58,58.42 52.06,56.9 15.99,56.9 12.75,53.66 IC4.3
LEDOUT1  (via drill 0.3)
  Top 0.254: IC5.3 44.5,55.44 v44.69,55.63 | IC1.5 48.11,68.33 v45.71,68.33
  Bottom 0.254: v44.69,55.63 44.69,67.31 v45.71,68.33
LEDOUT_TEST  (via drill 0.3)
  Top 0.254: IC7.14 41.94,92.25 40.98,91.29 40.1,91.29 38.58,89.77 37.17,89.77 36.82,89.41 36.82,83.5 35.37,82.05 35.37,81.8 34.44,80.87 34.34,80.78 31.23,80.78 v30.47,80.01 | v31.48,68.08 31.48,66.37 IC6.6
  Bottom 0.254: v30.47,80.01 30.47,69.09 v31.48,68.08
LEDOUT_TEST_5V  (via drill 0.3)
  Top 0.254: v26.15,55.63 15.99,55.63 14.65,54.29 IC4.1 | v46.47,52.84 46.47,50.29 IC5.1 | IC6.5 30.34,62.62 v26.15,58.42
  Bottom 0.254: v26.15,58.42 v26.15,55.63 28.18,53.6 45.71,53.6 v46.47,52.84
N$1
  Top 0.254: R4.2 LED1.A
N$2
  Top 0.254: LED2.A R5.2
N$3
  Top 0.254: R8.1 SV4.1
N$4
  Top 0.254: R10.2 LED3.A
N$5
  Top 0.254: LED4.A R11.2
N$6
  Top 0.254: R9.1 SV3.1
N$7
  Top 0.254: IC9.3 14.54,65.72 15.29,64.96 C20.2
OUT0
  Top 0.254: IC4.4 12.75,43.69 R9.2
OUT0_MUX  (via drill 0.3)
  Top 0.254: v40.37,99.83 40.64,99.56 IC7.9 | R6.2 27.54,62.15 27.54,65.98 IC6.3 27.8,67.95 v27.67,68.08 | SV5.3 34.78,82.87 34.2,82.29 34.2,81.61 33.77,81.18 30.87,81.18 30.72,81.03 v30.69,81.06
  Bottom 0.254: SV5.3 31.13,89.01 31.13,99.57 31.74,100.18 40.02,100.18 v40.37,99.83 | v27.67,68.08 27.42,68.33 25.13,68.33 23.61,69.85 23.61,77.22 27.45,81.06 v30.69,81.06
OUT0_MUX_5V  (via drill 0.3)
  Top 0.254: IC6.4 29.07,63.38 v29.2,63.25 | v28.18,55.12 20.88,47.83 IC4.6
  Bottom 0.254: v29.2,63.25 29.2,56.14 v28.18,55.12
OUT0_N  (via drill 0.3)
  Top 0.254: IC1.1 57.14,70.17 57.14,71.38 57.39,71.63 v57.9,71.63
  Bottom 0.254: SV1.1 65.39,71.76 R1.1 58.02,71.76 v57.9,71.63
OUT0_P  (via drill 0.3)
  Top 0.254: IC1.2 56.12,70.94 56.12,73.41 57.14,74.43 v57.64,74.43
  Bottom 0.254: SV1.2 65.39,74.56 R1.2 57.77,74.56 v57.64,74.43
OUT1
  Top 0.254: IC5.4 44.5,43.69 R8.2
OUT1_MUX
  Top 0.254: IC7.1 46.98,97.54 46.98,78.49 42.66,74.17 38.85,74.17 | 38.85,74.17 33.77,74.17 32.88,73.28 IC6.10 | R7.2 38.85,74.17
OUT1_MUX_5V  (via drill 0.3)
  Top 0.254: IC6.11 31.61,69.98 v31.74,69.85 | IC5.6 47.05,47.83 47.48,48.26 v47.48,52.84
  Bottom 0.254: v31.74,69.85 31.99,69.85 32.5,69.35 32.5,55.88 33.77,54.61 45.96,54.61 47.48,53.09 v47.48,52.84
OUT1_N  (via drill 0.3)
  Top 0.254: IC1.7 57.49,81.28 v58.15,81.28
  Bottom 0.254: SV1.3 65.65,81.41 R2.1 60.31,81.28 v58.15,81.28
OUT1_P  (via drill 0.3)
  Top 0.254: IC1.6 57.14,79.14 v57.14,79.51
  Bottom 0.254: SV1.4 65.14,84.21 R2.2 58.79,84.21 57.14,82.55 v57.14,79.51
SHUNT+  (via drill 0.3)
  Top 0.254: IC9.8 12.67,70.89 v11.92,71.63
  Bottom 0.254: v11.92,71.63 9.89,73.66 9.89,105.92
SHUNT-  (via drill 0.3)
  Top 0.254: IC9.1 12.16,66.79 v11.67,66.3
  Bottom 0.254: v11.67,66.3 10.15,64.77 10.15,40.9 4.3,35.06
SPI_MISO  (via drill 0.3)
  Top 0.254: IC8.2 28.94,92.08 | 28.94,92.08 29.83,92.08 30.72,92.97 v32.24,92.97 | IC7.12 40.64,93.72 40.37,93.98 39.1,93.98 v38.59,93.48 | R10.1 29.45,76.2 28.94,76.71 28.94,82.55 27.93,83.57 v27.93,87.89 | v26.66,91.95 28.82,91.95 28.94,92.08
  Bottom 0.254: v32.24,92.97 38.09,92.97 v38.59,93.48 | v27.93,87.89 27.93,90.68 v26.66,91.95
SPI_MOSI  (via drill 0.3)
  Top 0.254: IC7.13 41.29,92.17 40.81,91.7 39.93,91.7 38.41,90.17 35.8,90.17 35.42,89.79 | 35.42,89.79 35.17,89.54 IC8.5 | 35.42,89.79 36.31,88.9 36.31,83.57 v34.78,82.05 | v48.75,67.31 48.9,67.31 IC1.4
  Bottom 0.254: v34.78,82.05 44.18,72.65 44.18,71.12 47.99,67.31 v48.75,67.31
SPI_SCK  (via drill 0.3)
  Top 0.254: IC7.11 39.99,92.33 38.47,90.81 IC8.6 33.39,90.81 33.01,90.43 33.01,87.63 33.51,87.13 33.51,82.55 v33.01,82.05 | v31.23,79 R11.1
  Bottom 0.254: v33.01,82.05 31.23,80.27 v31.23,79
UART_TX  (via drill 0.3)
  Top 0.254: v41.13,100.33 41.29,100.18 IC7.8
  Bottom 0.254: SV5.2 32.24,86.62 30.72,88.14 30.72,99.83 31.48,100.59 40.88,100.59 v41.13,100.33

### Text on the board
tNames: +5V In | +5V Good | +3V3 Good | Channel 0 | Channel 1 | Lichtenstein Differential Output / © 2018 Tristan Seifert | Rev 01